# Altium schematic sheet NTC_Head.SchDoc: Sheetname
size A4; Date: 05.10.2017; CheckedBy: UNCHECKED; Author: Team Member; Organization: Baltic Racing; Address1: Zur Schwedenschanze 15; Address2: Haus 18; Address3: 18435 Stralsund; Revision: xx.xx; SheetNumber: 1; SheetTotal: 1; Rules: TODO; ProjectName: Projekt
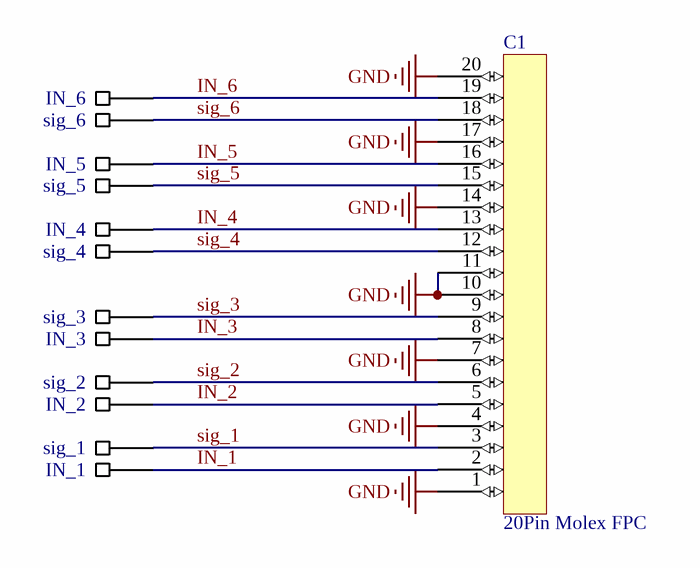
[diagram p0: NTC_Head.SchDoc]

## Parts
C1  20Pin Molex FPC  [Molex 20 Pin FPC]
IN_1  Pad  [Generic_Pad_1.5x1.5]  (value not drawn)
IN_2  Pad  [Generic_Pad_1.5x1.5]  (value not drawn)
IN_3  Pad  [Generic_Pad_1.5x1.5]  (value not drawn)
IN_4  Pad  [Generic_Pad_1.5x1.5]  (value not drawn)
IN_5  Pad  [Generic_Pad_1.5x1.5]  (value not drawn)
IN_6  Pad  [Generic_Pad_1.5x1.5]  (value not drawn)
sig_1  Pad  [Generic_Pad_1.5x1.5]  (value not drawn)
sig_2  Pad  [Generic_Pad_1.5x1.5]  (value not drawn)
sig_3  Pad  [Generic_Pad_1.5x1.5]  (value not drawn)
sig_4  Pad  [Generic_Pad_1.5x1.5]  (value not drawn)
sig_5  Pad  [Generic_Pad_1.5x1.5]  (value not drawn)
sig_6  Pad  [Generic_Pad_1.5x1.5]  (value not drawn)

## Nets
GND: C1.1 C1.4 C1.7 C1.10 C1.11 C1.14 C1.17 C1.20
IN_1: C1.2 IN_1.P(Pad)
IN_2: C1.5 IN_2.P(Pad)
IN_3: C1.8 IN_3.P(Pad)
IN_4: C1.13 IN_4.P(Pad)
IN_5: C1.16 IN_5.P(Pad)
IN_6: C1.19 IN_6.P(Pad)
sig_1: C1.3 sig_1.P(Pad)
sig_2: C1.6 sig_2.P(Pad)
sig_3: C1.9 sig_3.P(Pad)
sig_4: C1.12 sig_4.P(Pad)
sig_5: C1.15 sig_5.P(Pad)
sig_6: C1.18 sig_6.P(Pad)

## Notes on the sheet
- Title:
- Projekt:
- Revision:
- Author:
- Rules:
- Checked by:
- Sheet
- of
- Size:
- A4
- Date:
- Time:

## Library data of the parts
C1 = 20Pin Molex FPC: Flex PCB part for the Molex 20pin FCC
IN_1-IN_6 sig_1-sig_6 = Generic_Pad_1.5x1.5: Pad 1.5mm x 1.5mm